# Altium schematic sheet BM680.SchDoc
size A4; SheetNumber: 6; SheetTotal: 6
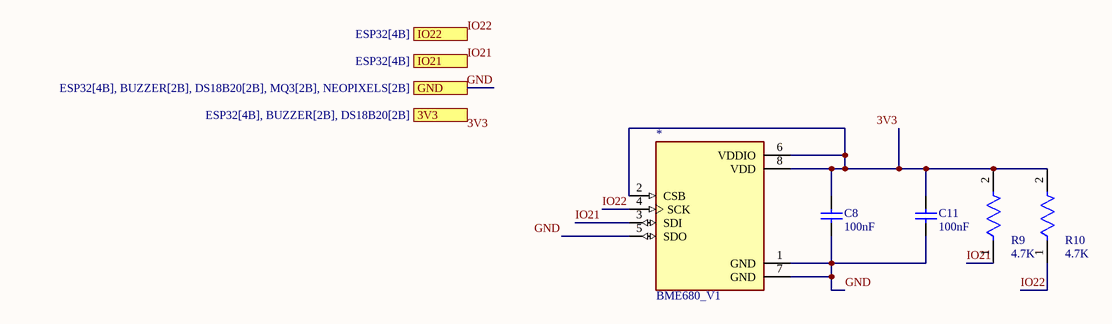
[diagram p0: BM680.SchDoc]

## Parts
*  BME680_V1  [BME680]
C8  100nF  [CAPC2013X140X50ML20T25]
C11  100nF  [CAPC2013X140X50ML20T25]
R9  4.7K  [FP-ERA6A-IPC_B]
R10  4.7K  [FP-ERA6A-IPC_B]

## Ports
3V3 (see ESP32[4B], BUZZER[2B], DS18B20[2B]), GND (see ESP32[4B], BUZZER[2B], DS18B20[2B], MQ3[2B], NEOPIXELS[2B]), IO21 (see ESP32[4B]), IO22 (see ESP32[4B])

## Nets
3V3: *.2(CSB) *.6(VDDIO) *.8(VDD) C8.2 C11.2 R9.2 R10.2 ; port 3V3
GND: *.1(GND) *.5(SDO) *.7(GND) C8.1 C11.1 ; port GND
IO21: *.3(SDI) R9.1 ; port IO21
IO22: *.4(SCK) R10.1 ; port IO22

## Library data of the parts
C8 C11 = CMP-2007-03242-1: 10µF ±10% 16V Ceramic Capacitor X5R 0805 (2012 Metric); Part Number: CL21A106KOQNNNG
R9 R10 = CMP-2001-00583-2: RES 100K OHM 0.1% 1/8W 0805; Max Power Dissipation: 125mW; Voltage Rating: 100V; Resistance: 100kR; Temperature Coefficient: 25ppm/°C; Resistance Tolerance: 0.1%; Resistor Type: Thin Film; Mount: Surface Mount; Package Quantity: 1; RoHS Compliant: Yes; Features: Automotive AEC-Q200; Termination: Solder; Contact Plating: Tin; Number of Pins: 2; Construction: Rectangular; Size Code: 0805; Case/Package: 0805; Military Standard: Not; Voltage Rating (DC): 100V; Max Operating Temperature: 155°C; REACH SVHC: No SVHC; Series: ERA-6A; Case Code (Metric): 2012; Number of Terminations: 2; Tolerance: 0.1%; Width: 1.25mm; Depth: 1.25mm; Lead Free: Lead Free; Radiation Hardening: No; Length: 2mm; Technology: METAL FILM; Power Rating: 125mW; Min Operating Temperature: -55°C; Height: 0.5mm; Case Code (Imperial): 0805; Packaging: Tape and Reel